# Altium schematic sheet mag-encoder-v2.SchDoc
size A4
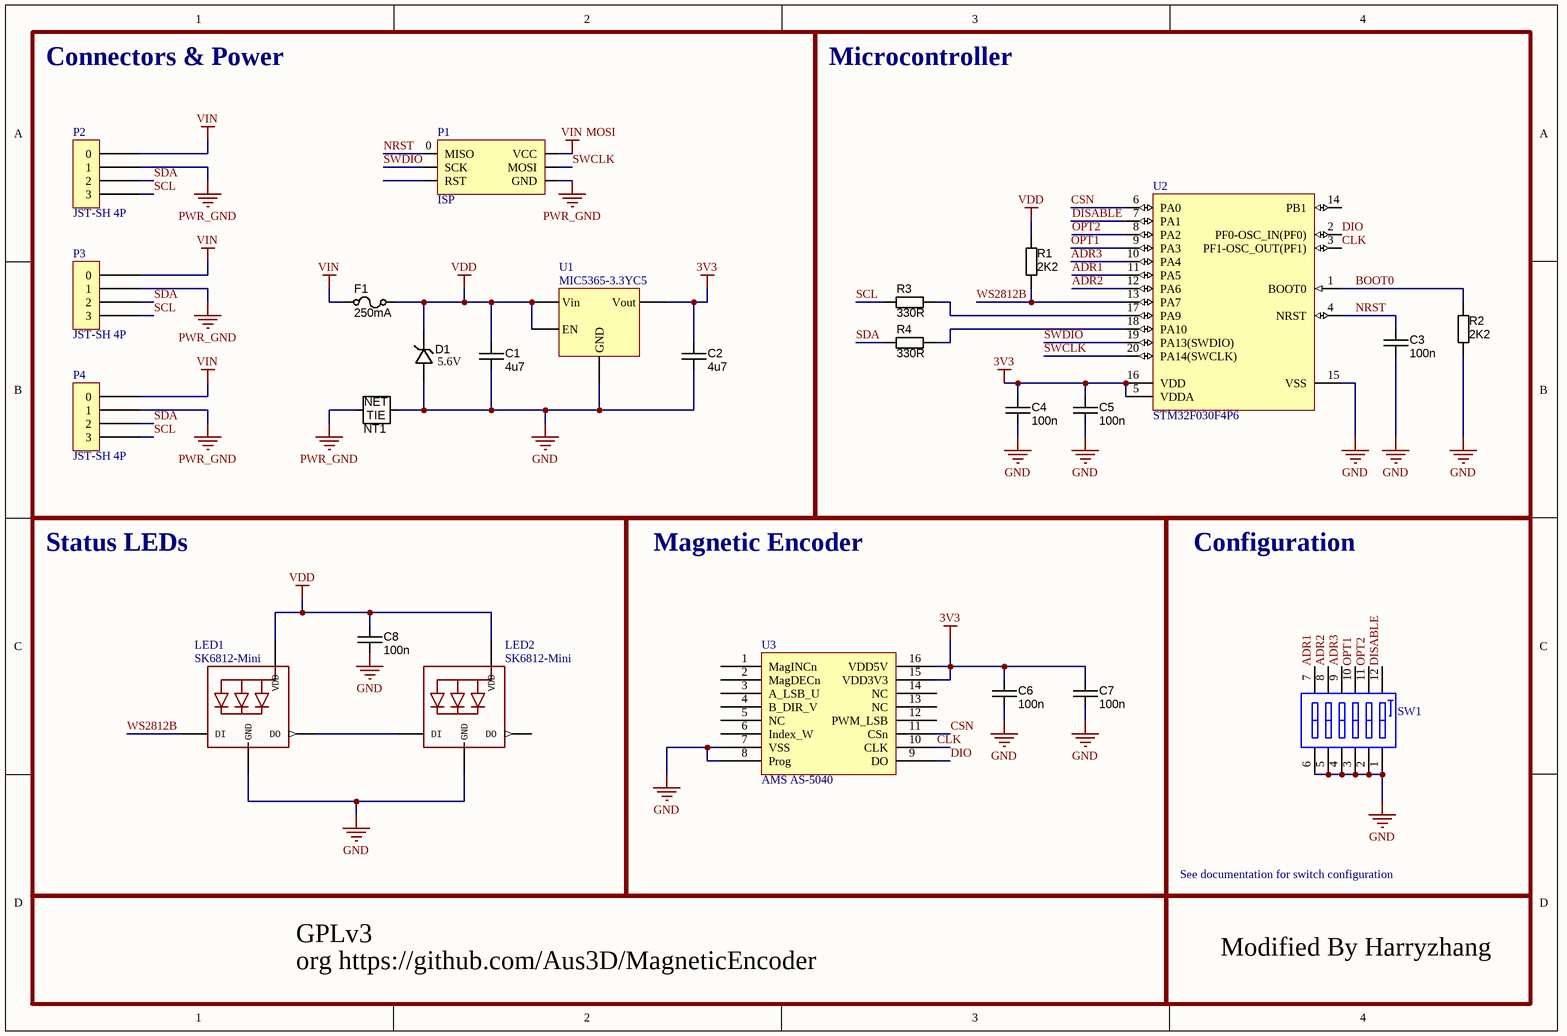
[diagram p0: mag-encoder-v2.SchDoc]

## Parts
C1  value 4u7  [CAPC1608X90N]  (hidden comment: Approved sub OK)
C2  value 4u7  [CAPC1608X90N]  (hidden comment: Approved sub OK)
C3  value 100n  [CAPC1005X55N]  (hidden comment: Approved sub OK)
C4  value 100n  [CAPC1005X55N]  (hidden comment: Approved sub OK)
C5  value 100n  [CAPC1005X55N]  (hidden comment: Approved sub OK)
C6  value 100n  [CAPC1005X55N]  (hidden comment: Approved sub OK)
C7  value 100n  [CAPC1005X55N]  (hidden comment: Approved sub OK)
C8  value 100n  [CAPC1005X55N]  (hidden comment: Approved sub OK)
D1  value 5.6V  [SOD123]  (hidden comment: Approved sub OK)
F1  value 250mA  [PTC Fuse1608-0603]  (hidden comment: Approved sub OK)
LED1  SK6812-Mini  [SK6812]
LED2  SK6812-Mini  [SK6812]
NT1  Net Tie  [NetTie_Internal2_24mil]  (value not drawn)  (net tie, no BOM)
P1  ISP  [ICSP Pads - SMD]  (no BOM)
P2  JST-SH 4P  [SM04B-SRSS-TB]
P3  JST-SH 4P  [SM04B-SRSS-TB]
P4  JST-SH 4P  [SM04B-SRSS-TB]
R1  value 2K2  [RESC1005X40N]  (hidden comment: Approved sub OK)
R2  value 2K2  [RESC1005X40N]  (hidden comment: Approved sub OK)
R3  value 330R  [RESC1005X40N]  (hidden comment: Approved sub OK)
R4  value 330R  [RESC1005X40N]  (hidden comment: Approved sub OK)
SW1  Approved sub OK  [DIPSW SMD 6 Way]  (value not drawn)
U1  MIC5365-3.3YC5  [SC70-5]
U2  STM32F030F4P6  [STM-TSSOP20_N]
U3  AMS AS-5040  [SSOP-16_L4.9-W3.9-P0.64-LS6.0-BL]

## Blocks framed on the sheet
Connectors & Power: C1 C2 D1 F1 NT1 P1-P4 U1
Microcontroller: C3-C5 R1-R4 U2
Status LEDs: C8 LED1 LED2
Magnetic Encoder: C6 C7 U3
Configuration: SW1

## Nets
3V3: C2.1 C4.1 C5.1 C6.1 C7.1 U1.5(Vout) U2.5(VDDA) U2.16(VDD) U3.15(VDD3V3) U3.16(VDD5V)
GND: C1.2 C2.2 C3.2 C4.2 C5.2 C6.2 C7.2 C8.2 D1.A LED1.4(GND) LED2.4(GND) NT1.2 R2.2 SW1.1(A1) SW1.2(A2) SW1.3(A3) SW1.4 SW1.5 SW1.6 U1.2(GND) U2.15(VSS) U3.7(VSS) U3.8(Prog)
PWR_GND: NT1.1 P1.5(GND) P2.1 P3.1 P4.1
VDD: C1.1 C8.1 D1.K F1.2 LED1.2(VDD) LED2.2(VDD) R1.1 U1.1(Vin) U1.3(EN)
VIN: F1.1 P1.1(VCC) P2.0 P3.0 P4.0
ADR1: SW1.7 U2.11(PA5)
ADR2: SW1.8 U2.12(PA6)
ADR3: SW1.9 U2.10(PA4)
BOOT0: R2.1 U2.1(BOOT0)
CLK: U2.3(PF1-OSC_OUT(PF1)) U3.10(CLK)
CSN: U2.6(PA0) U3.11(CSn)
DIO: U2.2(PF0-OSC_IN(PF0)) U3.9(DO)
DISABLE: SW1.12 U2.7(PA1)
NRST: C3.1 P1.0(MISO) U2.4(NRST)
OPT1: SW1.10 U2.9(PA3)
OPT2: SW1.11 U2.8(PA2)
SCL: P2.3 P3.3 P4.3 R3.1
SDA: P2.2 P3.2 P4.2 R4.1
SWCLK: P1.3(MOSI) U2.20(PA14(SWCLK))
SWDIO: P1.2(SCK) U2.19(PA13(SWDIO))
WS2812B: LED1.1(DI) R1.2 U2.13(PA7)
NetLED1_3: LED1.3(DO) LED2.1(DI)
NetR3_2: R3.2 U2.17(PA9)
NetR4_2: R4.2 U2.18(PA10)

Not connected (* = marked no-connect by the designer): LED2 3(DO); P1 4(RST); U2 14(PB1); U3 1(MagINCn) 2(MagDECn) 3(A_LSB_U) 4(B_DIR_V) 5(NC) 6(Index_W) 12(PWM_LSB) 13(NC) 14(NC)

## Notes on the sheet
- See documentation for switch configuration
- org https://github.com/Aus3D/MagneticEncoder
- GPLv3
- Modified By Harryzhang
- Labels drawn without touching a wire or pin: MOSI
- (in symbol JUMP_NETTIE) NET; TIE

## Library data of the parts
C1 C2 = CAPC_100n_0603_X7R_50V_10%: Capacitor SMD Cer 4.7uF 10% 16V X5R 0603; Manufacturer 1: Samsung Electro-Mechanics America, Inc.; Manufacturer Part Number 1: CL10A475KO8NNNC; Ratings: 16V; X5R; Material: ceramic; SCDType: spec; Manufacturer 2: TDK Corporation; Manufacturer Part Number 2: C1608X7R1H104K; Package / Case: 0603 (1608 Metric); Tolerance: ±10%; Supplier 1: Digi-Key; Supplier Part Number 1: 1276-2087-1-ND; ComponentLink1URL: http://www.avx.com/docs/Catalogs/cx7r.pdf; ComponentLink1Description: http://www.avx.com/docs/Catalogs/cx7r.pdf; Supplier 2: Digi-Key; Supplier Part Number 2: 1276-2087-1-ND; ComponentLink2URL: http://product.tdk.com/capacitor/mlcc/en/documents/mlcc_commercial_general_en.pdf; ComponentLink2Description: http://product.tdk.com/capacitor/mlcc/en/documents/mlcc_commercial_general_en.pdf
C3-C8 = CAPC_100n_0402_X5R_16V_10%: Capacitor SMD Cer 100nF 10% 16V X5R 0402; Manufacturer 1: AVX Corporation; Manufacturer Part Number 1: 0402YD104KAT2A; Ratings: 16V; X5R; SCDType: spec; Tolerance: ±10%; Operating Temperature: -55°C ~ 125°C; Package / Case: 0402 (1005 Metric); Size / Dimension: 0.039" L x 0.020" W (1.00mm x 0.50mm); Supplier 1: Digi-Key; Supplier Part Number 1: 478-1126-1-ND; ComponentLink1URL: http://www.avx.com/docs/Catalogs/cx5r.pdf; ComponentLink1Description: http://www.avx.com/docs/Catalogs/cx5r.pdf; Supplier 2: Digi-Key; Supplier Part Number 2: 311-1347-1-ND; Manufacturer 2: Yageo; Manufacturer Part Number 2: CC0402KRX5R7BB104; ComponentLink2URL: http://www.yageo.com/documents/recent/UPY-GPHC_X5R_4V-to-50V_12.pdf; ComponentLink2Description: http://www.yageo.com/documents/recent/UPY-GPHC_X5R_4V-to-50V_12.pdf
D1 = DIODE_ZENER_5.6V_500mW: Diode Zener SMD 5.6V 0.5W SOD-123 BZT52C5V6; Ratings: 5.6V; 0.5W; Vf=900mV @ 10mA; Material: Si; Tolerance: ±7%; SCDType: source; Package / Case: SOD-123; Diode Type: Zener; Supplier 1: Digi-Key; Supplier Part Number 1: BZT52C5V6-FDICT-ND
F1 = Fuse - 15V 100mA Hold 250mA Trip PTC SMD 0603: Ratings: 160mA; 63VDC; slow-blow; SCDType: spec; Package / Case: 0603 (1608 metric); Supplier 1: Digi-Key; Supplier Part Number 1: 507-1818-1-ND
LED1 LED2 = WS2812B3535: RGB Smart LED WS2812 / SK6812 Mini 3535; Manufacturer 1: DONGGUANG OPSCO OPTOELECTRONICS CO., LTD; Manufacturer Part Number 1: SK6812MINI
NT1 = JUMP_NETTIE
P1 = ISP Header
P2-P4 = SM04B-SRSS-TB: JST SH 4P Connector; Supplier 1: Digi-Key; Supplier Part Number 1: 455-1804-1-ND
R1 R2 = RES_2K2_0402_5%: Resistor SMD chip 2.2k Ohm 0.063W 5% 0402; Manufacturer 1: Vishay Dale; Manufacturer Part Number 1: CRCW04022K20JNED; Ratings: 1/16 W; SCDType: spec; Package / Case: 0402 (1005 metric); Tolerance: ±5%; Material: Thick Film; Manufacturer 2: Yageo; Manufacturer Part Number 2: RC0402JR-072K2L; Supplier 1: Digi-Key; Supplier Part Number 1: 541-2.2KJCT-ND; ComponentLink1URL: http://www.vishay.com/doc?20035; ComponentLink1Description: http://www.vishay.com/doc?20035; Supplier 2: Digi-Key; Supplier Part Number 2: 311-2.2KJRCT-ND; ComponentLink2URL: http://www.yageo.com/documents/recent/PYu-RC0402_51_RoHS_L_6.pdf; ComponentLink2Description: http://www.yageo.com/documents/recent/PYu-RC0402_51_RoHS_L_6.pdf
R3 R4 = RES_330R_0402_5%: Resistor SMD chip 330 Ohm 0.063W 5% 0402; Manufacturer 1: Yageo; Manufacturer Part Number 1: RC0402JR-07330RL; Ratings: 1/16 W; SCDType: spec; Package / Case: 0402 (1005 Metric); Tolerance: ±5%; Supplier 1: Digi-Key; Supplier Part Number 1: 311-330JRCT-ND; ComponentLink1URL: http://www.yageo.com/documents/recent/PYu-RC0402_51_RoHS_L_6.pdf; ComponentLink1Description: http://www.yageo.com/documents/recent/PYu-RC0402_51_RoHS_L_6.pdf
SW1 = SW DIP-6: SMD DIP Switch 1.27mm Pitch 6 Position; Published: 24-Mar-1999; Revision: July-2002: Re-released for DXP Platform.; Publisher: Altium Limited; Supplier 1: Digi-Key; Supplier Part Number 1: 450-1950-1-ND
U1 = Regulator - MIC5365 3.3V Linear Regulator: 3.3V LDO Regulator; Supplier 1: Digi-Key; Supplier Part Number 1: 576-3193-1-ND
U2 = STM32F030F4P6: ARM Cortex-M0 32-bit MCU, 16 KB Flash, 4 KB Internal RAM, 15 I/Os, 20-pin TSSOP, -40 to 85 degC, Tube; FLASH Size (Prog) (kB): 16; I/Os (High Current): 15; Internal RAM Size (kB): 4; Operating Frequency(F) (Processor speed) (MHz): 48; Supply Voltage(Vcc) min (V): 2.4; DatasheetVersion: Rev. 1; PackageVersion: Rev. 1, 11/2012; PackageReference: TSSOP20; PackageDescription: 20-Pin Thin Shrink Small Outline Package, 6.5 x 4.4 mm Body, 0.65 mm Pitch; Supplier 1: Digi-Key; Supplier Part Number 1: 497-14044-5-ND; Supplier 2: Newark; Supplier Part Number 2: 06X3648; Supplier 3: Mouser; Supplier Part Number 3: 511-STM32F030F4P6; Core: ARM Cortex-M0; Packing: Tube; Mounting Technology: Surface Mount; PartNumber: STM32F030F4P6; ComponentLink1Description: Manufacturer URL; ComponentLink1URL: http://www.st.com/web/en/home.html; ComponentLink2Description: Datasheet; ComponentLink2URL: http://www.st.com/st-web-ui/static/active/en/resource/technical/document/datasheet/DM00088500.pdf; ComponentLink3Description: Package Specification; ComponentLink3URL: http://www.st.com/st-web-ui/static/active/en/resource/technical/document/datasheet/DM00065136.pdf
U3 = AMS AS-5040: AMS 10-bit Linear Magnetic Encoder IC; Supplier 1: Digi-Key; Supplier Part Number 1: AS5311-ATST-500CT-ND